# EAGLE design Arduino_CS (EAGLE 7.2.0)

## Sheet 1 of 2: Input Layer
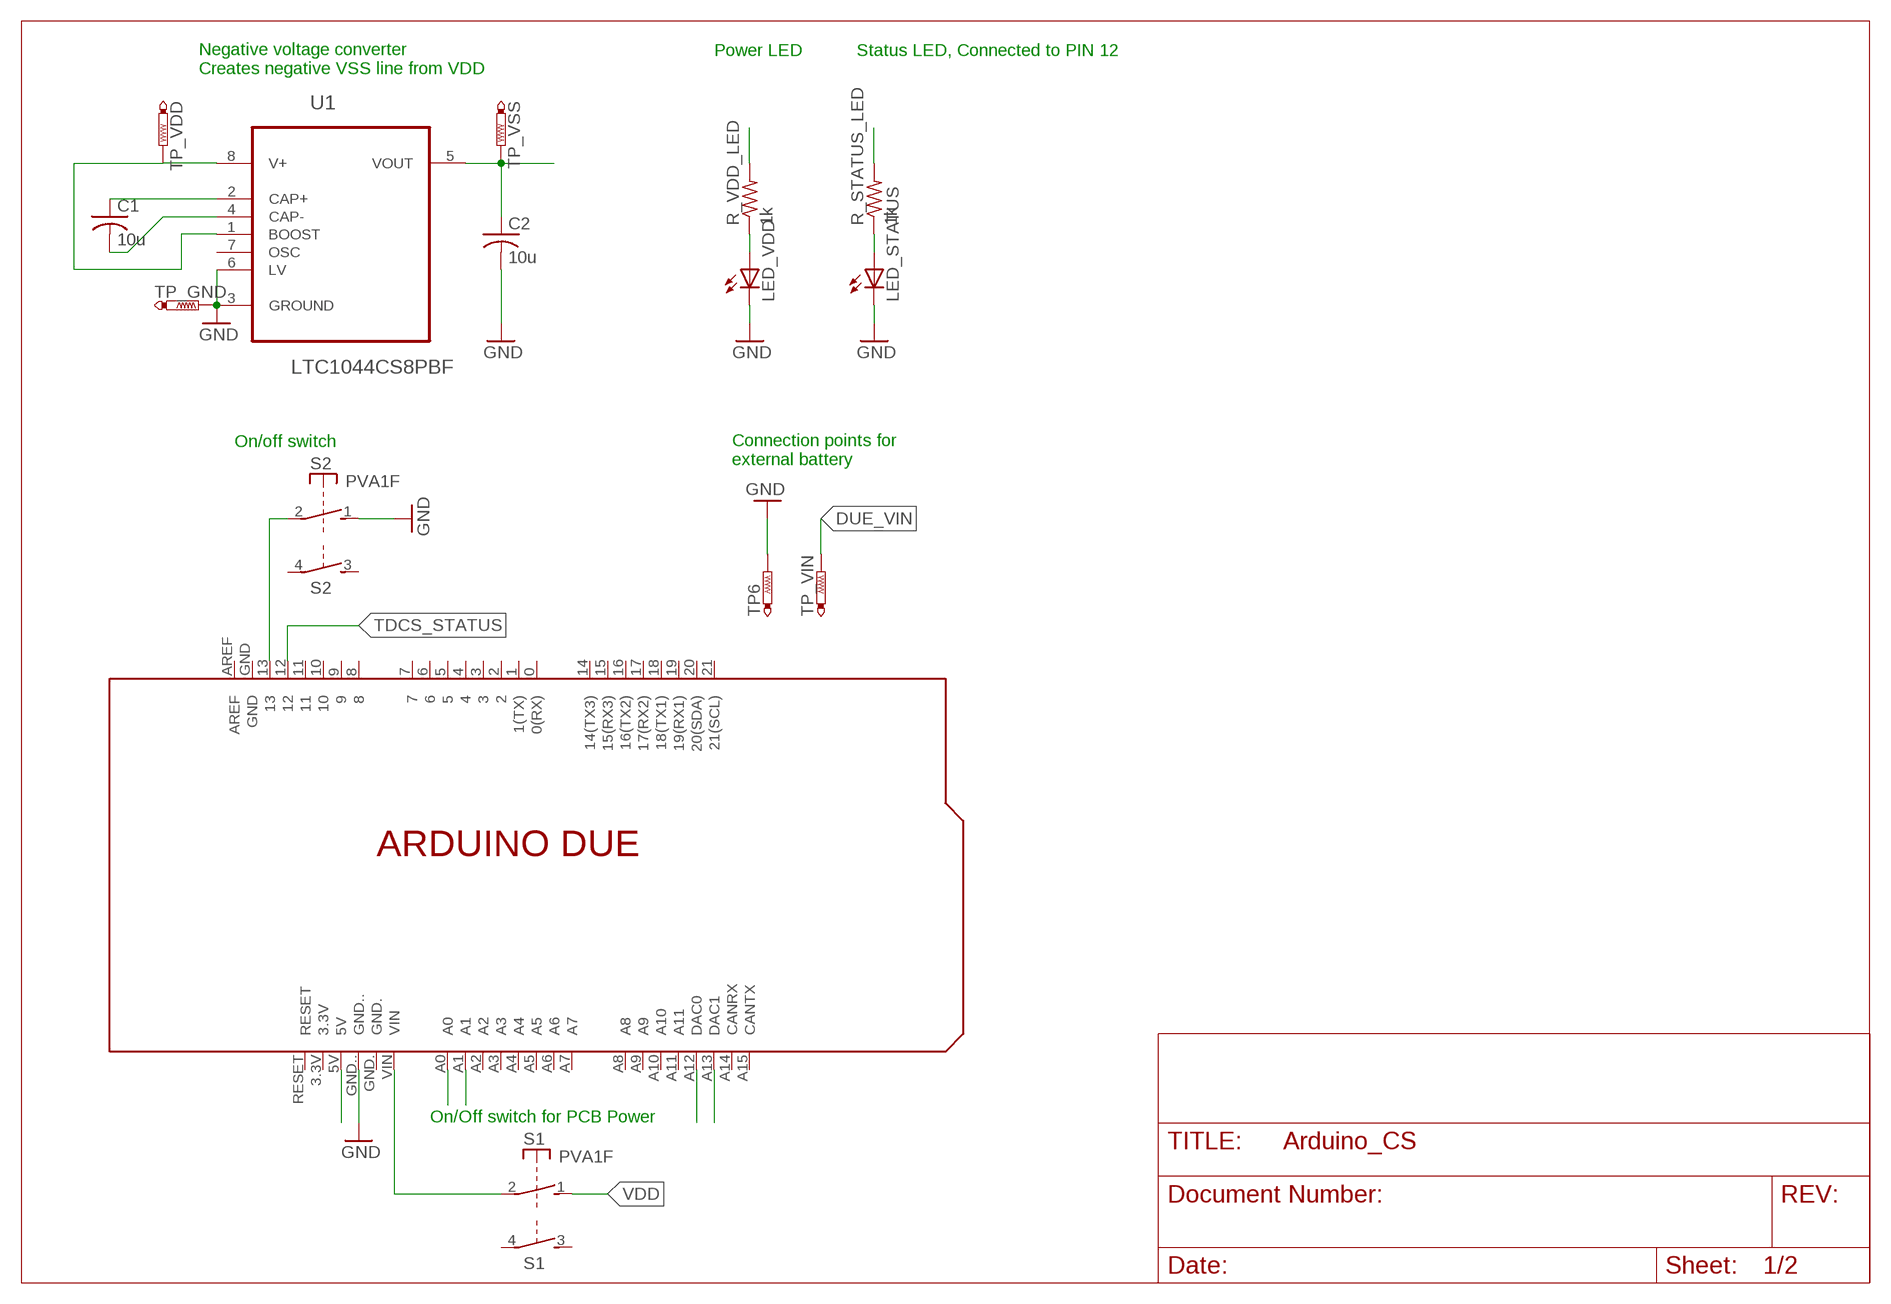
[diagram p0: schematic, sheet 1]

### Parts
C1  10u  C-USC0805  [C0805]
C2  10u  C-USC0805  [C0805]
LED_STATUS  LEDSML0805  [SML0805]
LED_VDD  LEDSML0805  [SML0805]
PCB1  ARDUINO_DUE  [ARDUINO_DUE]
R_STATUS_LED  1k  R-US_M0805  [M0805]
R_VDD_LED  1k  R-US_M0805  [M0805]
S1  PVA1F  [PVA1F]
S2  PVA1F  [PVA1F]
TP6  PTR1PAD1-13  [P1-13]
TP_GND  PTR1PAD1-13  [P1-13]
TP_VDD  PTR1PAD1-13  [P1-13]
TP_VIN  PTR1PAD1-13  [P1-13]
TP_VSS  PTR1PAD1-13  [P1-13]
U1  LTC1044CS8PBF  [SOIC127P600X175-8N]

### Nets
A0: PCB1.A0 ; also sheet 2
A1: PCB1.A1
DAC0: PCB1.A12(DAC0) ; also sheet 2
DAC1: PCB1.A13(DAC1)
DUE_5V: PCB1.5V ; also sheet 2
DUE_VIN: PCB1.VIN S1.2(1:P) TP_VIN.TP
GND: C2.2 LED_STATUS.C LED_VDD.C PCB1.GND.. S2.1(1:S) TP6.TP TP_GND.TP U1.3(GROUND) U1.6(LV) ; also sheet 2
N$5: PCB1.13 S2.2(1:P)
N$15: C1.1 U1.2(CAP+)
N$16: C1.2 U1.4(CAP-)
N$18: LED_STATUS.A R_STATUS_LED.1
N$21: LED_VDD.A R_VDD_LED.1
TDCS_STATUS: PCB1.12 R_STATUS_LED.2
VDD: R_VDD_LED.2 S1.1(1:S) TP_VDD.TP U1.1(BOOST) U1.8(V+) ; also sheet 2
VSS: C2.1 TP_VSS.TP U1.5(VOUT) ; also sheet 2
Unconnected: PCB1.0(0(RX)) PCB1.1(1(TX)) PCB1.2 PCB1.3 PCB1.3.3V PCB1.4 PCB1.5 PCB1.6 PCB1.7 PCB1.8 PCB1.9 PCB1.10 PCB1.11 PCB1.14(14(TX3)) PCB1.15(15(RX3)) PCB1.16(16(TX2)) PCB1.17(17(RX2)) PCB1.18(18(TX1)) PCB1.19(19(RX1)) PCB1.20(20(SDA)) PCB1.21(21(SCL)) PCB1.A2 PCB1.A3 PCB1.A4 PCB1.A5 PCB1.A6 PCB1.A7 PCB1.A8 PCB1.A9 PCB1.A10 PCB1.A11 PCB1.A14(CANRX) PCB1.A15(CANTX) PCB1.AREF PCB1.GND PCB1.GND. PCB1.RESET S1.3(2:S) S1.4(2:P) S2.3(2:S) S2.4(2:P) U1.7(OSC)

### Notes on the sheet
- Power LED | Status LED, Connected to PIN 12
- Negative voltage converter
  Creates negative VSS line from VDD
- On/off switch
- Connection points for
  external battery
- On/Off switch for PCB Power

## Sheet 2 of 2: Current Source Block
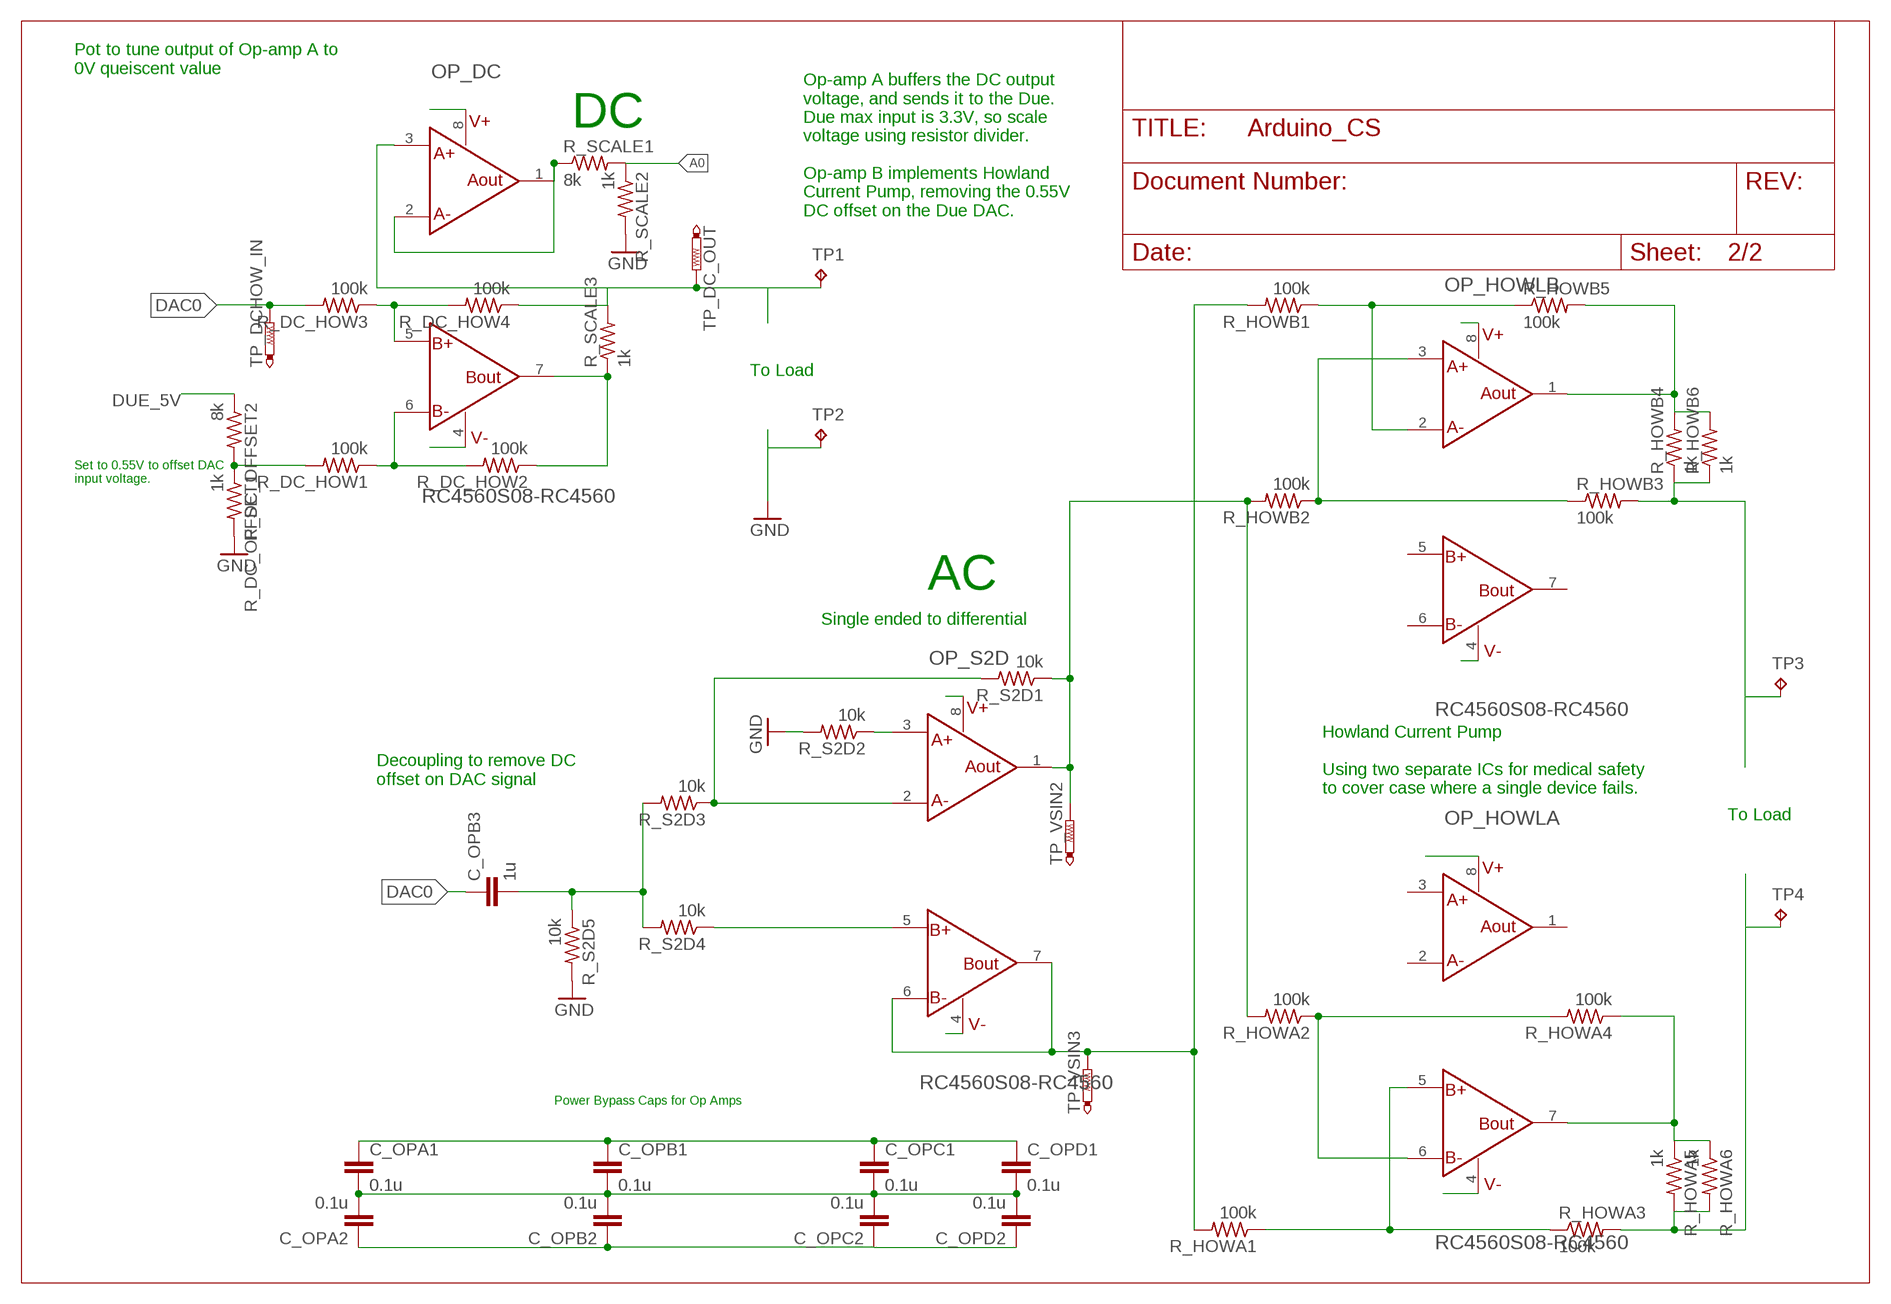
[diagram p1: schematic, sheet 2]

### Parts
C_OPA1  0.1u  C-EUC0805  [C0805]
C_OPA2  0.1u  C-EUC0805  [C0805]
C_OPB1  0.1u  C-EUC0805  [C0805]
C_OPB2  0.1u  C-EUC0805  [C0805]
C_OPB3  1u  C-EUC0805  [C0805]
C_OPC1  0.1u  C-EUC0805  [C0805]
C_OPC2  0.1u  C-EUC0805  [C0805]
C_OPD1  0.1u  C-EUC0805  [C0805]
C_OPD2  0.1u  C-EUC0805  [C0805]
OP_DC  RC4560S08-RC4560  [SO8]
OP_HOWLA  RC4560S08-RC4560  [SO8]
OP_HOWLB  RC4560S08-RC4560  [SO8]
OP_S2D  RC4560S08-RC4560  [SO8]
R_DC_HOW1  100k  R-US_R0805  [R0805]
R_DC_HOW2  100k  R-US_R0805  [R0805]
R_DC_HOW3  100k  R-US_R0805  [R0805]
R_DC_HOW4  100k  R-US_R0805  [R0805]
R_DC_OFFSET1  1k  R-US_R0805  [R0805]
R_DC_OFFSET2  8k  R-US_R0805  [R0805]
R_HOWA1  100k  R-US_R0805  [R0805]
R_HOWA2  100k  R-US_R0805  [R0805]
R_HOWA3  100k  R-US_R0805  [R0805]
R_HOWA4  100k  R-US_R0805  [R0805]
R_HOWA5  1k  R-US_R0805  [R0805]
R_HOWA6  1k  R-US_R0805  [R0805]
R_HOWB1  100k  R-US_R0805  [R0805]
R_HOWB2  100k  R-US_R0805  [R0805]
R_HOWB3  100k  R-US_R0805  [R0805]
R_HOWB4  1k  R-US_R0805  [R0805]
R_HOWB5  100k  R-US_R0805  [R0805]
R_HOWB6  1k  R-US_R0805  [R0805]
R_S2D1  10k  R-US_R0805  [R0805]
R_S2D2  10k  R-US_R0805  [R0805]
R_S2D3  10k  R-US_R0805  [R0805]
R_S2D4  10k  R-US_R0805  [R0805]
R_S2D5  10k  R-US_R0805  [R0805]
R_SCALE1  8k  R-US_R0805  [R0805]
R_SCALE2  1k  R-US_R0805  [R0805]
R_SCALE3  1k  R-US_R0805  [R0805]
TP1  TPPAD1-20  [P1-20]
TP2  TPPAD1-20  [P1-20]
TP3  TPPAD1-20  [P1-20]
TP4  TPPAD1-20  [P1-20]
TP_DC_OUT  PTR1PAD1-13  [P1-13]
TP_DCHOW_IN  PTR1PAD1-13  [P1-13]
TP_VSIN2  PTR1PAD1-13  [P1-13]
TP_VSIN3  PTR1PAD1-13  [P1-13]

### Nets
A0: R_SCALE1.2 R_SCALE2.1 ; also sheet 1
DAC0: C_OPB3.1 R_DC_HOW3.2 TP_DCHOW_IN.TP ; also sheet 1
DUE_5V: R_DC_OFFSET2.1 ; also sheet 1
GND: C_OPA1.2 C_OPA2.2 C_OPB1.2 C_OPB2.2 C_OPC1.2 C_OPC2.2 C_OPD1.2 C_OPD2.2 R_DC_OFFSET1.2 R_S2D2.2 R_S2D5.2 R_SCALE2.2 TP2.TP ; also sheet 1
N$1: OP_DC.6(NEGB) R_DC_HOW1.1 R_DC_HOW2.2
N$2: R_DC_HOW1.2 R_DC_OFFSET1.1 R_DC_OFFSET2.2
N$3: C_OPB3.2 R_S2D3.2 R_S2D4.2 R_S2D5.1
N$4: OP_S2D.6(NEGB) OP_S2D.7(OUTB) R_HOWA1.2 R_HOWB1.2 TP_VSIN3.TP
N$6: OP_S2D.5(POSB) R_S2D4.1
N$7: OP_HOWLA.5(POSB) R_HOWA1.1 R_HOWA3.1
N$8: OP_S2D.1(OUTA) R_HOWA2.2 R_HOWB2.2 R_S2D1.1 TP_VSIN2.TP
N$9: OP_S2D.3(POSA) R_S2D2.1
N$10: OP_S2D.2(NEGA) R_S2D1.2 R_S2D3.1
N$11: OP_HOWLB.3(POSA) R_HOWB2.1 R_HOWB3.1
N$12: OP_HOWLB.2(NEGA) R_HOWB1.1 R_HOWB5.1
N$13: R_HOWB3.2 R_HOWB4.1 R_HOWB6.1 TP3.TP
N$14: R_HOWA3.2 R_HOWA5.2 R_HOWA6.2 TP4.TP
N$17: OP_HOWLA.7(OUTB) R_HOWA4.1 R_HOWA5.1 R_HOWA6.1
N$19: OP_DC.7(OUTB) R_DC_HOW2.1 R_SCALE3.1
N$20: OP_HOWLA.6(NEGB) R_HOWA2.1 R_HOWA4.2
N$22: OP_DC.1(OUTA) OP_DC.2(NEGA) R_SCALE1.1
N$24: OP_HOWLB.1(OUTA) R_HOWB4.2 R_HOWB5.2 R_HOWB6.2
N$25: OP_DC.3(POSA) R_DC_HOW4.1 R_SCALE3.2 TP1.TP TP_DC_OUT.TP
N$26: OP_DC.5(POSB) R_DC_HOW3.1 R_DC_HOW4.2
VDD: C_OPA1.1 C_OPB1.1 C_OPC1.1 C_OPD1.1 OP_DC.8(V+) OP_HOWLA.8(V+) OP_HOWLB.8(V+) OP_S2D.8(V+) ; also sheet 1
VSS: C_OPA2.1 C_OPB2.1 C_OPC2.1 C_OPD2.1 OP_DC.4(V-) OP_HOWLA.4(V-) OP_HOWLB.4(V-) OP_S2D.4(V-) ; also sheet 1
Unconnected: OP_HOWLA.1(OUTA) OP_HOWLA.2(NEGA) OP_HOWLA.3(POSA) OP_HOWLB.5(POSB) OP_HOWLB.6(NEGB) OP_HOWLB.7(OUTB)

### Notes on the sheet
- Pot to tune output of Op-amp A to
  0V queiscent value
- DC
- Op-amp A buffers the DC output
  voltage, and sends it to the Due.
  Due max input is 3.3V, so scale
  voltage using resistor divider.
  
  Op-amp B implements Howland
  Current Pump, removing the 0.55V
  DC offset on the Due DAC.
- To Load
- Set to 0.55V to offset DAC
  input voltage.
- AC
- Single ended to differential
- Decoupling to remove DC
  offset on DAC signal
- Howland Current Pump
  
  Using two separate ICs for medical safety
  to cover case where a single device fails.
- To Load
- Power Bypass Caps for Op Amps

## Library data of the parts
C1 C2 = adafruit:C-US: CAPACITOR, American symbol
C_OPA1 C_OPA2 C_OPB1-C_OPB3 C_OPC1 C_OPC2 C_OPD1 C_OPD2 = resistor:C-EU: CAPACITOR, European symbol
LED_STATUS LED_VDD = led:LED: LED OSRAM: - CHIPLED LG R971, LG N971, LY N971, LG Q971, LY Q971, LO R971, LY R971 LH N974, LH R974 LS Q976, LO Q976, LY Q976 LO Q996 - Hyper CHIPLED LW Q18S LB Q993, LB Q99A, LB R99A - SideLED LS A670, LO A670, LY A670, LG A670, LP A670 LB A673, LV A673, LT A673, LW A673 LH A674 LY A675 LS A676, LA A676, LO A676, LY A676, LW A676 LS A679, LY A679, LG A679 - Hyper Micro SIDELED® LS Y876, LA Y876, LO Y876, LY Y876 LT Y87S - SmartLED LW L88C, LW L88S LB L89C, LB L89S, LG L890 LS L89K, LO L89K, LY L89K LS L896, LA L896, LO L896, LY L896 - TOPLED LS T670, LO T670, LY T670, LG T670, LP T670 LSG T670, LSP T670, LSY T670, LOP T670, LYG T670 LG T671, LOG T671, LSG T671 LB T673, LV T673, LT T673, LW T673 LH T674 LS T676, LA T676, LO T676, LY T676, LB T676, LH T676, LSB T676, LW T676 LB T67C, LV T67C, LT T67C, LS T67K, LO T67K, LY T67K, LW E67C LS E67B, LA E67B, LO E67B, LY E67B, LB E67C, LV E67C, LT E67C LW T67C LS T679, LY T679, LG T679 LS T770, LO T770, LY T770, LG T770, LP T770 LB T773, LV T773, LT T773, LW T773 LH T774 LS E675, LA E675, LY E675, LS T675 LS T776, LA T776, LO T776, LY T776, LB T776 LHGB T686 LT T68C, LB T68C - Hyper Mini TOPLED® LB M676 - Mini TOPLED Santana® LG M470 LS M47K, LO M47K, LY M47K Source: http://www.osram.convergy.de LUXEON: - LUMILED® LXK2-PW12-R00, LXK2-PW12-S00, LXK2-PW14-U00, LXK2-PW14-V00 LXK2-PM12-R00, LXK2-PM12-S00, LXK2-PM14-U00 LXK2-PE12-Q00, LXK2-PE12-R00, LXK2-PE12-S00, LXK2-PE14-T00, LXK2-PE14-U00 LXK2-PB12-K00, LXK2-PB12-L00, LXK2-PB12-M00, LXK2-PB14-N00, LXK2-PB14-P00, LXK2-PB14-Q00 LXK2-PR12-L00, LXK2-PR12-M00, LXK2-PR14-Q00, LXK2-PR14-R00 LXK2-PD12-Q00, LXK2-PD12-R00, LXK2-PD12-S00 LXK2-PH12-R00, LXK2-PH12-S00 LXK2-PL12-P00, LXK2-PL12-Q00, LXK2-PL12-R00 Source: www.luxeon.com KINGBRIGHT: KA-3528ASYC Source: www.kingbright.com
OP_DC OP_HOWLA OP_HOWLB OP_S2D = RC4560:RC4560: RC4560 Op-Amp Texas Instruments
PCB1 = DUE_TDCS:ARDUINO_DUE: Device for representing an Arduino Due board with a footprint in an EAGLE design. Created by Dave Young for Element14. More EAGLE documentation at: http://www.element14.com/community/community/knode/cadsoft_eagle
R_DC_HOW1-R_DC_HOW4 R_DC_OFFSET1 R_DC_OFFSET2 R_HOWA1-R_HOWA6 R_HOWB1-R_HOWB6 R_S2D1-R_S2D5 R_SCALE1-R_SCALE3 = rcl:R-US_: RESISTOR, American symbol
R_STATUS_LED R_VDD_LED = resistor:R-US_: RESISTOR, American symbol
S1 S2 = switch-misc:PVA1: ITT SWITCH
TP1-TP4 = testpad:TP: Test pad
TP6 TP_DC_OUT TP_DCHOW_IN TP_GND TP_VDD TP_VIN TP_VSIN2 TP_VSIN3 TP_VSS = testpad:PTR1: TEST PIN
U1 = LTC_By_element14_Batch_1:LTC1044CS8PBF: Switched Capacitor Voltage Converter; MPN: LTC1044CS8#PBF; OC_FARNELL: 1663593; OC_NEWARK: 55M8900; PACKAGE: SOIC-8; SUPPLIER: Linear Technology

## Board
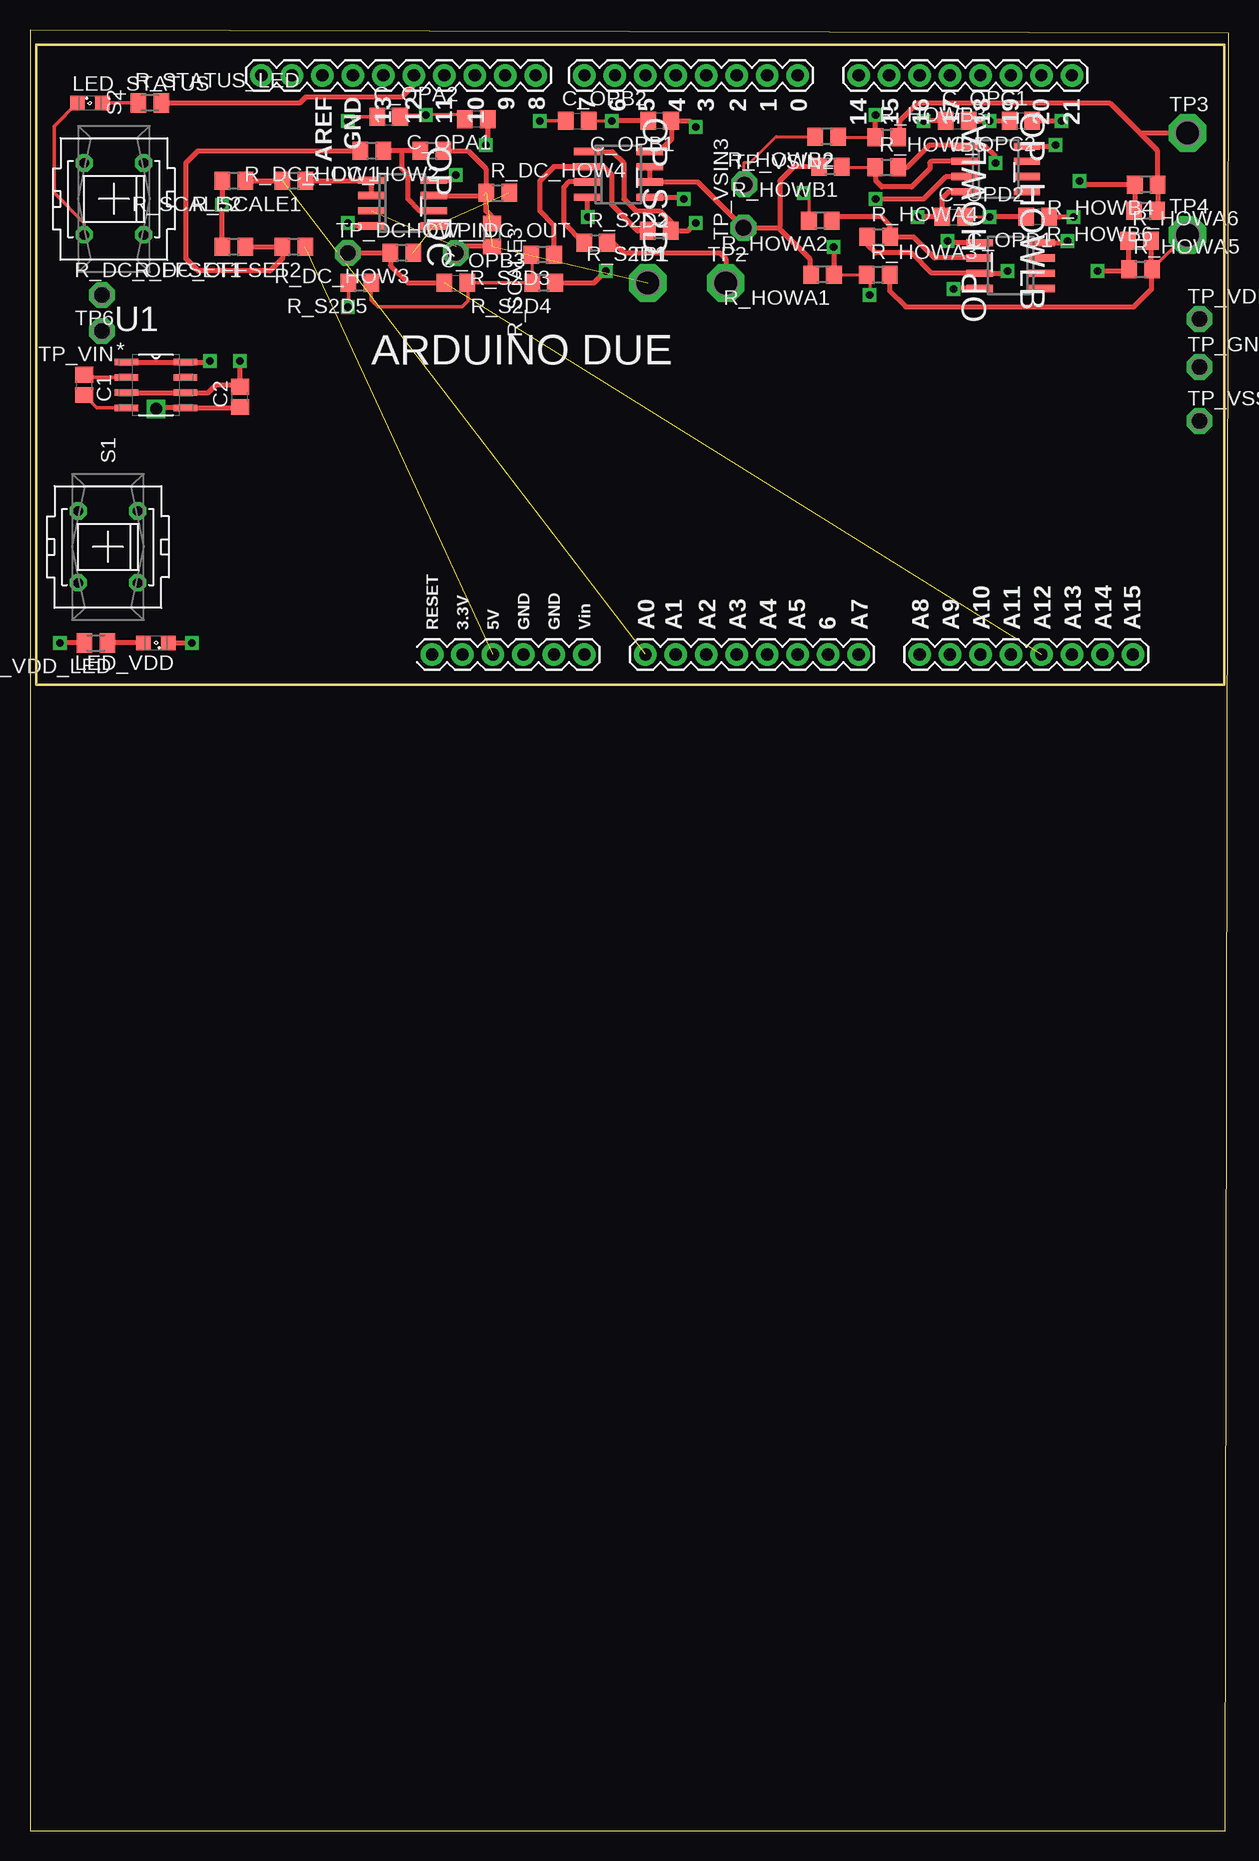
[diagram p2: board, top side]
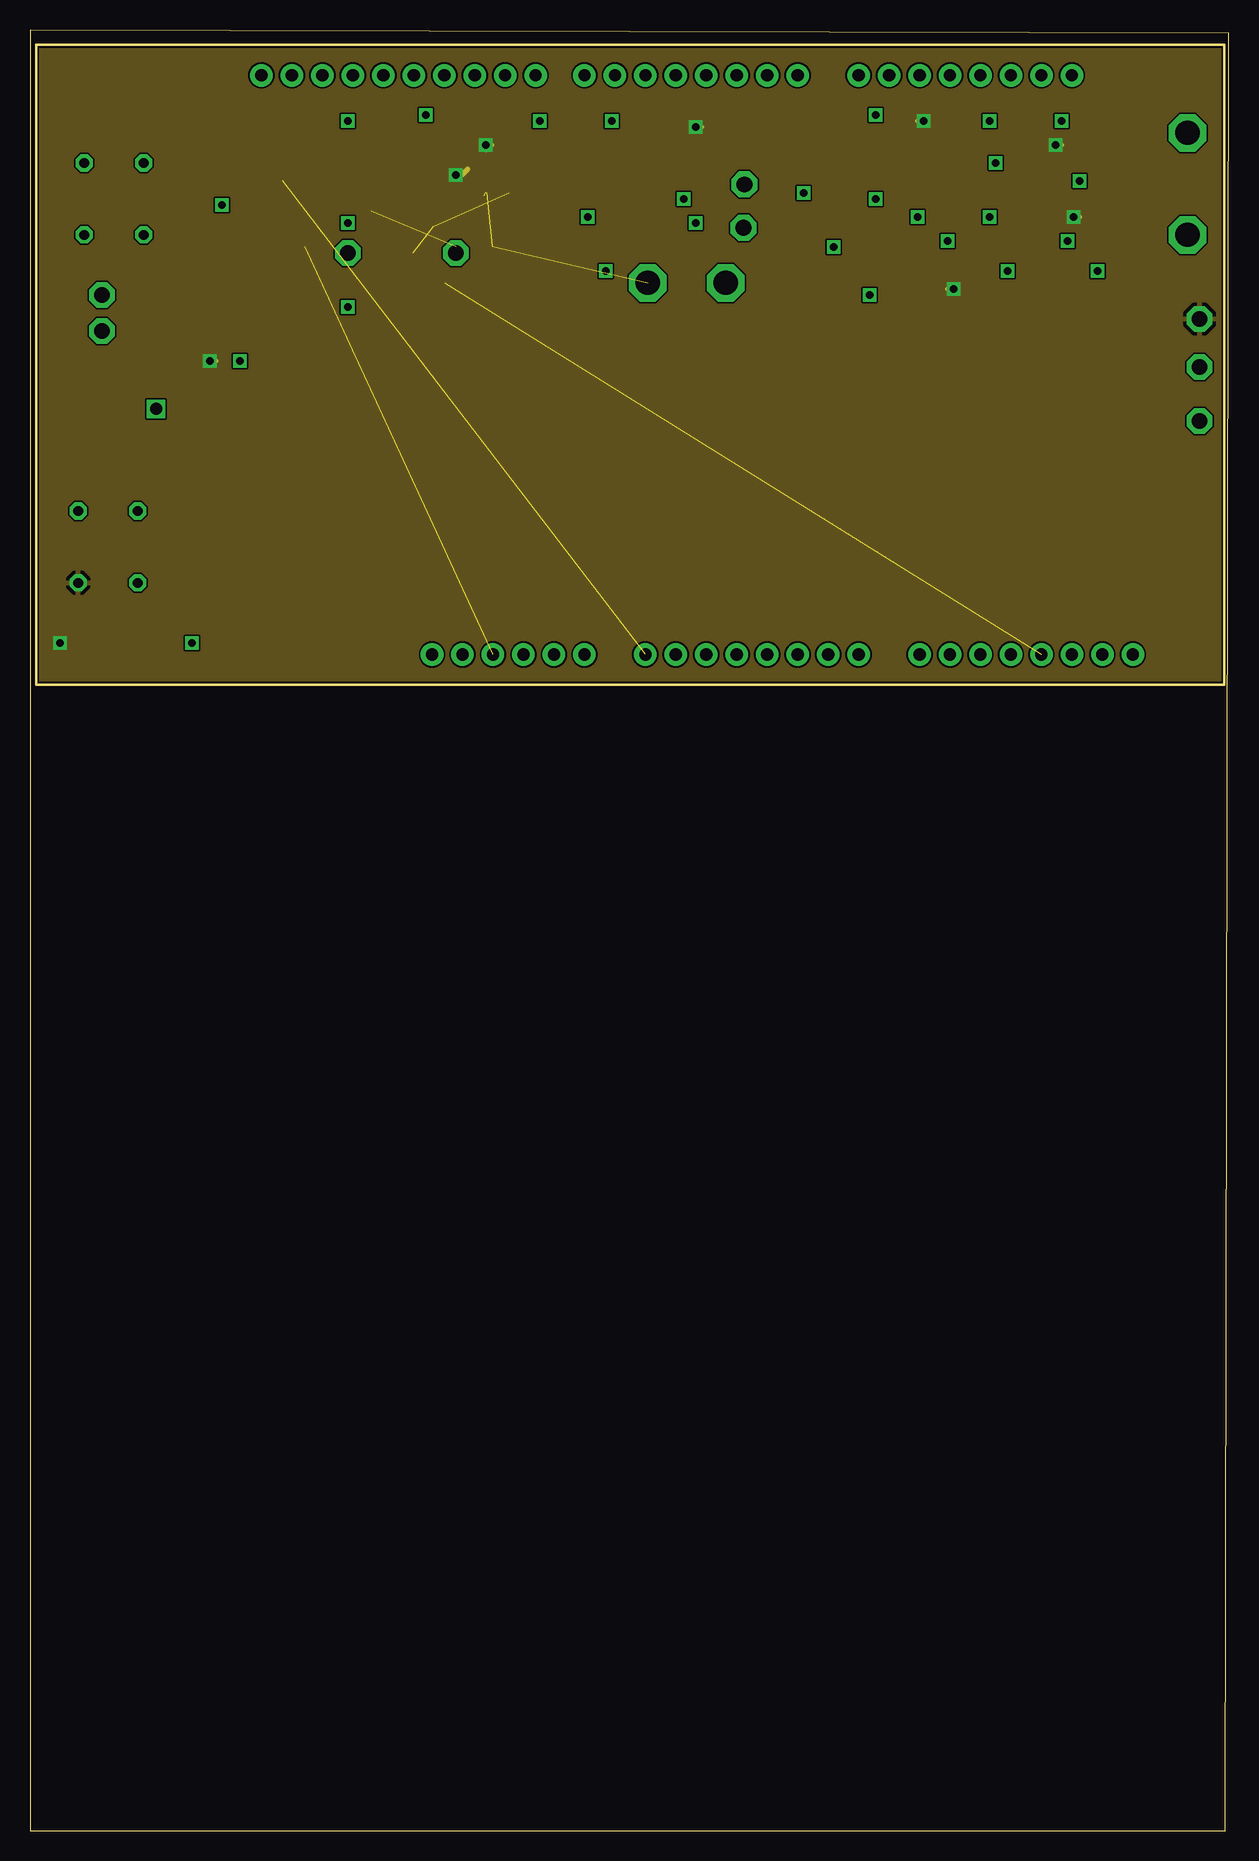
[diagram p3: board, inner layer VDD]
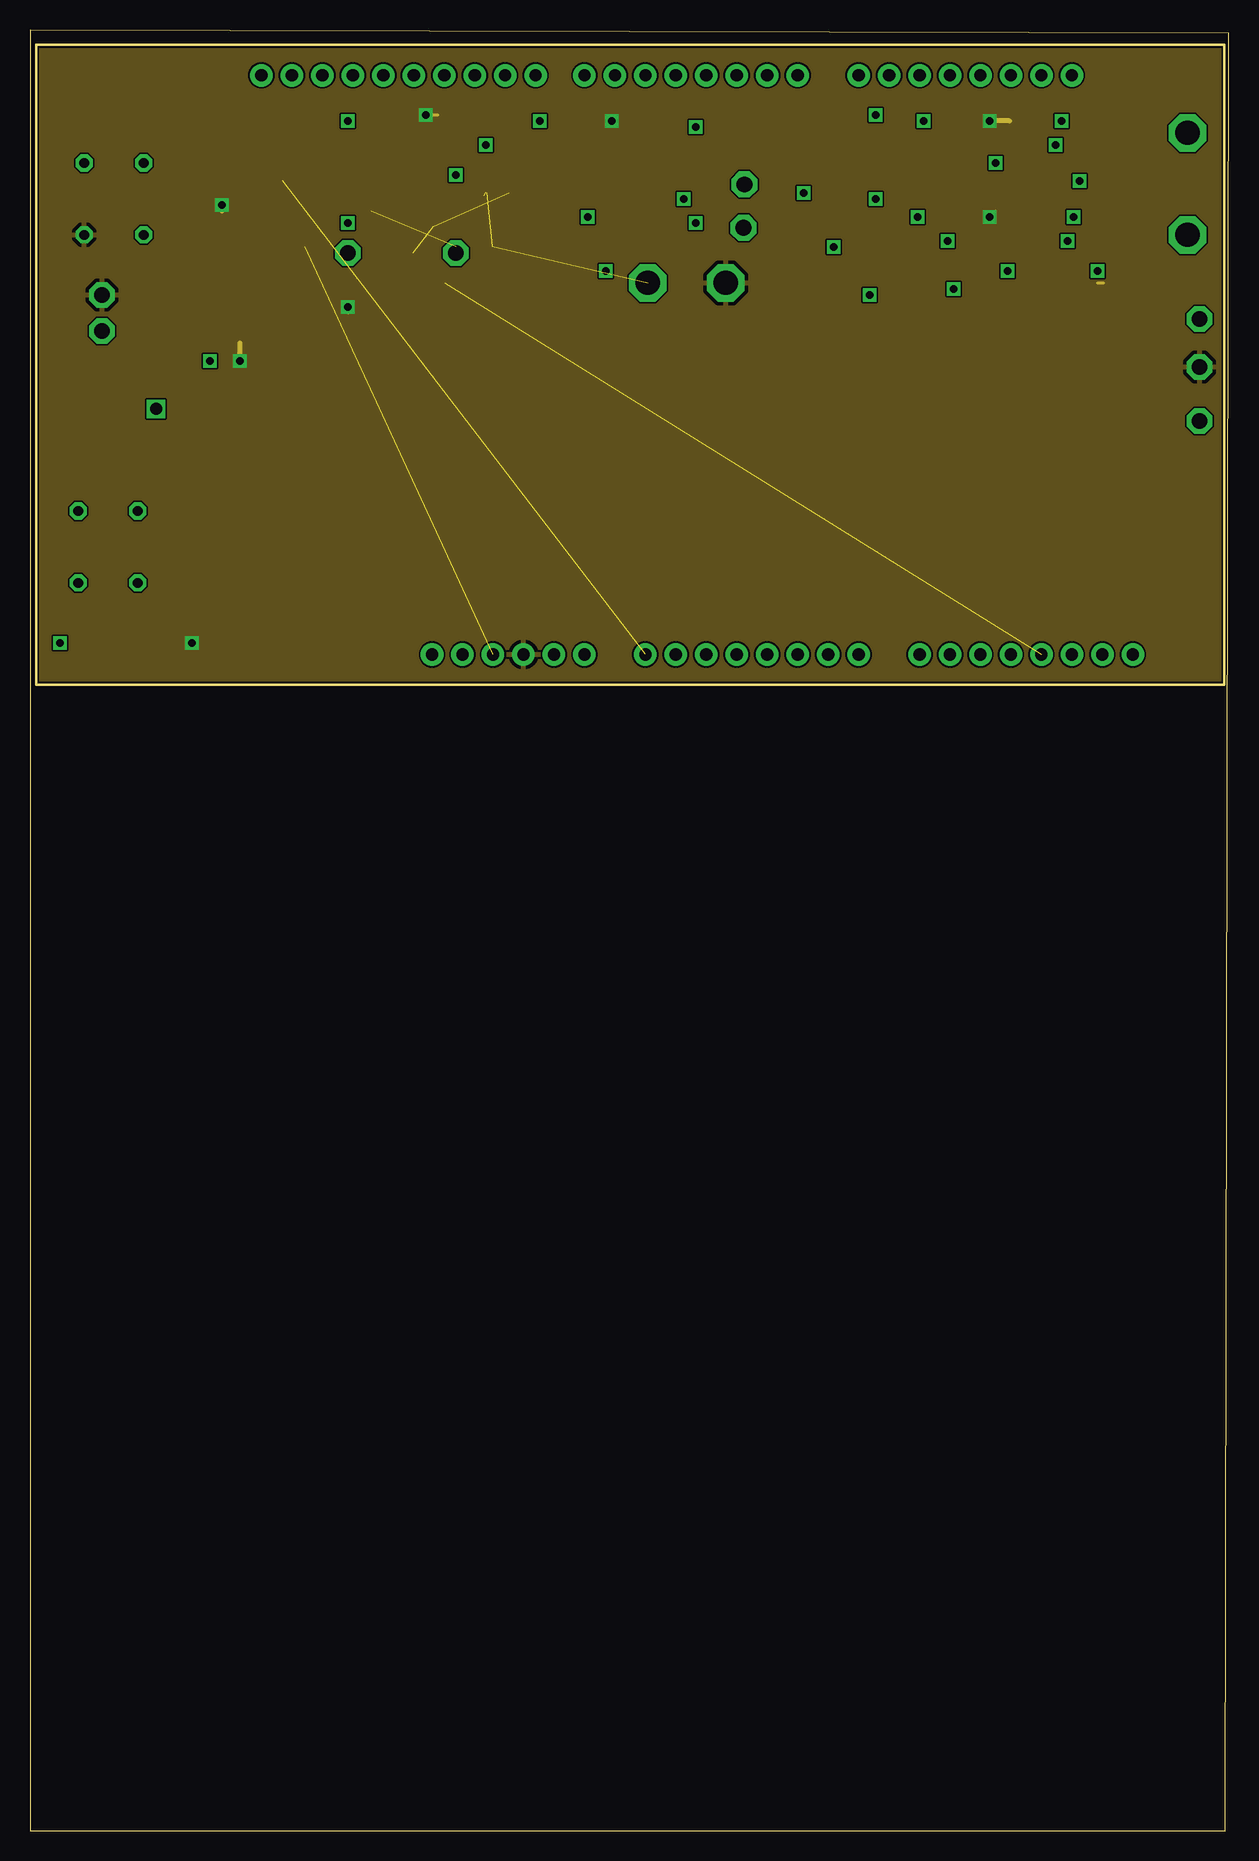
[diagram p4: board, inner layer GND]
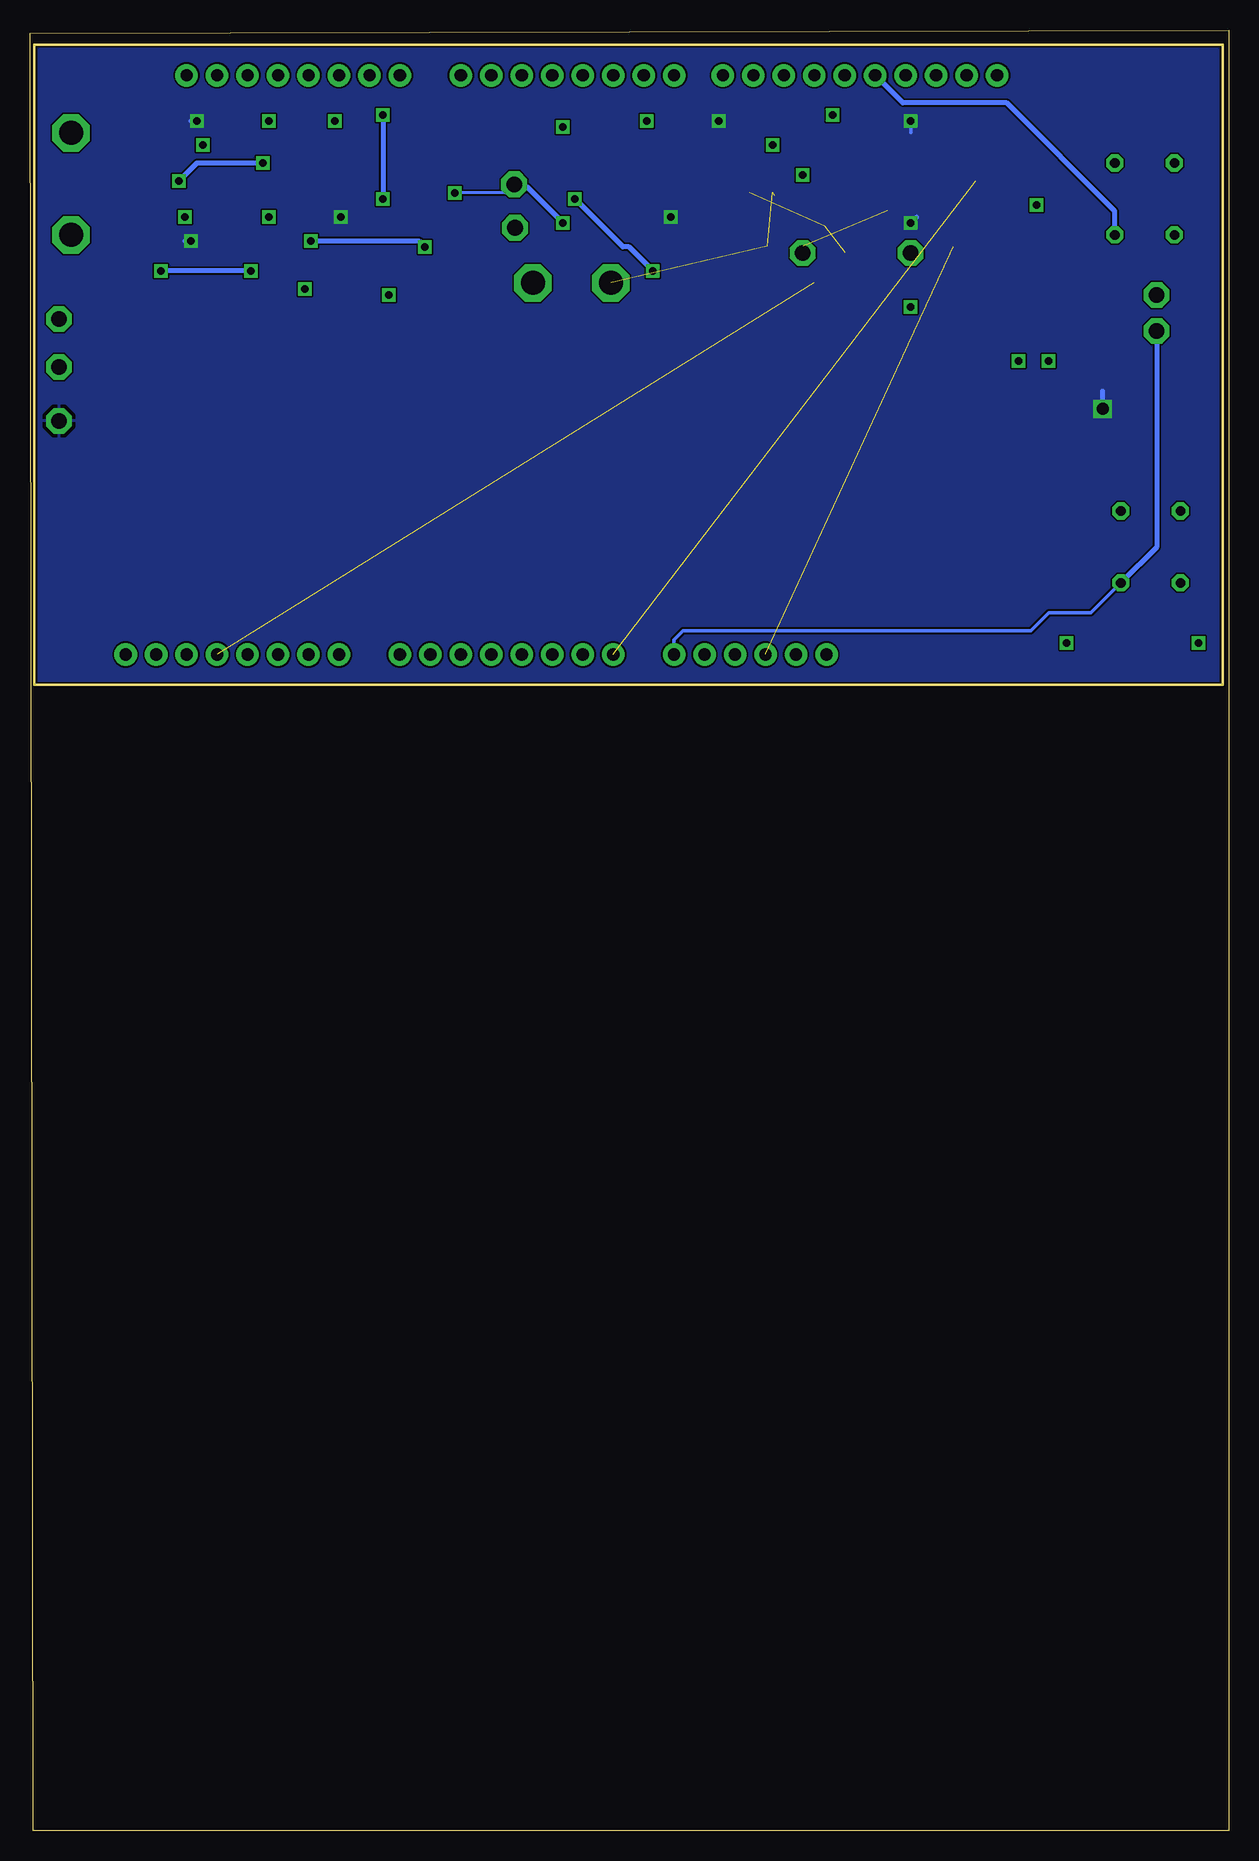
[diagram p5: board, bottom side, seen from below]

Size 99.92 x 150.08 mm. Coordinates in mm from the lower left corner, seen from the top.
Outline: 0,0 99.65,0 99.92,149.81 0,150.08 0,0
Copper layers (1*2*15*16): Top 0.035mm / dielectric 1.5mm / VDD 0.035mm / dielectric 0.15mm / GND 0.035mm / dielectric 0.2mm / Bottom 0.035mm
Design rules "SparkFun-4-layer": minimum track width 6mil, minimum drill 13mil, track to track 6mil, track to pad 6mil, pad to pad 6mil, via to via 6mil, smd to smd 6mil, copper to edge 6mil, drill to drill 8mil, minimum pad ring 12mil, minimum via ring 10mil, stop-mask expansion 4mil, vias tented up to drill 20mil, thermal gap 12mil

### Footprints (pad centres in the part's own frame; a part is rotated, then mirrored left to right if it is on the bottom)
C0805 = smd 1.3 x 1.5: 1 -0.85,0; 2 0.85,0
C0805' = smd 1.3 x 1.5: 1 -0.95,0; 2 0.95,0
SML0805 = smd 1.2 x 1.2: A 1.05,0; C -1.05,0
SO8 = smd 0.6 x 2.2: 1 -1.905,-2.6; 2 -0.635,-2.6; 3 0.635,-2.6; 4 1.905,-2.6; 5 1.905,2.6; 6 0.635,2.6; 7 -0.635,2.6; 8 -1.905,2.6
ARDUINO_DUE = drill 1.016 pad 1.88: 0 63.5,50.8; 1 60.96,50.8; 2 58.42,50.8; 3 55.88,50.8; 3.3V 35.56,2.54; 4 53.34,50.8; 5 50.8,50.8; 5V 38.1,2.54; 6 48.26,50.8; 7 45.72,50.8; 8 41.656,50.8; 9 39.116,50.8; 10 36.576,50.8; 11 34.036,50.8; 12 31.496,50.8; 13 28.956,50.8; 14 68.58,50.8; 15 71.12,50.8; 16 73.66,50.8; 17 76.2,50.8; 18 78.74,50.8; 19 81.28,50.8; 20 83.82,50.8; 21 86.36,50.8; A0 50.8,2.54; A1 53.34,2.54; A2 55.88,2.54; A3 58.42,2.54; A4 60.96,2.54; A5 63.5,2.54; A6 66.04,2.54; A7 68.58,2.54; A8 73.66,2.54; A9 76.2,2.54; A10 78.74,2.54; A11 81.28,2.54; A12 83.82,2.54; A13 86.36,2.54; A14 88.9,2.54; A15 91.44,2.54; AREF 23.876,50.8; GND 26.416,50.8; GND. 43.18,2.54; GND.. 40.64,2.54; RESET 33.02,2.54; SCL1 18.796,50.8; SDA1 21.336,50.8; VIN 45.72,2.54
R0805 = smd 1.3 x 1.5: 1 -0.95,0; 2 0.95,0
M0805 = smd 1.3 x 1.6: 1 -0.95,0; 2 0.95,0
PVA1F = drill 0.813 octagon: 1 -2.997,2.489; 2 -2.997,-2.489; 3 2.997,2.489; 4 2.997,-2.489
P1-20 = drill 2.007 pad 3.15 octagon: TP 0,0
P1-13 = drill 1.321 pad 2.159 octagon: TP 0,0
SOIC127P600X175-8N = smd 1.981 x 0.533: 1 -2.464,1.905; 2 -2.464,0.635; 3 -2.464,-0.635; 4 -2.464,-1.905; 5 2.464,-1.905; 6 2.464,-0.635; 7 2.464,0.635; 8 2.464,1.905

### Placement (x,y rotation side)
C1  4.5,120.5 270 top
C2  17.5,119.5 90 top
C_OPA1  0.1u  [C0805']  37.21,142.65 180 top
C_OPA2  0.1u  [C0805']  29.9,142.85 0 top
C_OPB1  0.1u  [C0805']  52.49,142.5 180 top
C_OPB2  0.1u  [C0805']  45.62,142.5 0 top
C_OPB3  1u  [C0805']  35.5,129 0 top
C_OPC1  0.1u  [C0805']  77.29,142.5 0 top
C_OPC2  0.1u  [C0805']  82.6,142.5 180 top
C_OPD1  0.1u  [C0805']  84,134.5 180 top
C_OPD2  0.1u  [C0805']  77,134.5 0 top
LED_STATUS  5,144 0 top
LED_VDD  10.5,99 180 top
OP_DC  31.05,135.65 270 top
OP_HOWLA  81.75,130.45 90 top
OP_HOWLB  80.5,138.5 270 top
OP_S2D  49.05,138.05 270 top
PCB1  0.5,95.5 0 top
R_DC_HOW1  28.5,140 180 top
R_DC_HOW2  33.5,140 180 top
R_DC_HOW3  31,131.5 180 top
R_DC_HOW4  39,136.5 0 top
R_DC_OFFSET1  17,132 180 top
R_DC_OFFSET2  22,132 180 top
R_HOWA1  66.07,129.7 180 top
R_HOWA2  65.89,134.2 180 top
R_HOWA3  70.71,129.7 0 top
R_HOWA4  70.75,132.85 0 top
R_HOWA5  92.59,130.15 0 top
R_HOWA6  92.5,132.5 0 top
R_HOWB1  66.73,138.7 180 top
R_HOWB2  66.41,141.2 180 top
R_HOWB3  71.43,141.15 0 top
R_HOWB4  93.05,137.2 180 top
R_HOWB5  71.41,138.65 0 top
R_HOWB6  93,135 180 top
R_S2D1  52.46,133.35 180 top
R_S2D2  47.15,132.35 0 top
R_S2D3  42.74,131.35 180 top
R_S2D4  42.82,129 180 top
R_S2D5  27.5,129 180 top
R_SCALE1  22,137.5 180 top
R_SCALE2  17,137.5 180 top
R_SCALE3  38.5,133 270 top
R_STATUS_LED  10,144 0 top
R_VDD_LED  5.5,99 180 top
S1  6.5,107 90 top
S2  7,136 90 top
TP1  51.5,129 0 top
TP2  58,129 0 top
TP3  96.5,141.5 0 top
TP4  96.5,133 0 top
TP6  6,128 180 top
TP_DC_OUT  35.5,131.5 0 top
TP_DCHOW_IN  26.5,131.5 0 top
TP_GND  97.5,122 0 top
TP_VDD  97.5,126 0 top
TP_VIN  6,125 180 top
TP_VSIN2  59.55,137.21 0 top
TP_VSIN3  59.49,133.59 90 top
TP_VSS  97.5,117.5 0 top
U1  10.5,120.5 0 top

### Tracks (layer width: path | path; a pad name or v marks a point on that pad's centre or on a via)
A0  (1 unrouted)
  Top 0.406: R_SCALE2.1 R_SCALE1.2
DAC0  (1 unrouted)
  Top 0.406: TP_DCHOW_IN.TP R_DC_HOW3.2 30.05,130.45 31.5,129 C_OPB3.1
DUE_5V  (1 unrouted)
DUE_VIN
  Bottom 0.305: PCB1.VIN 46.22,99.28 45.5,100 16.5,100 15,101.5 11.49,101.5 S1.2
  Bottom 0.406: TP_VIN.TP 6,106.99 S1.2
GND  (via drill 0.6)
  Top 0.254: C_OPA2.2 31,143 v33,143 35.91,143 C_OPA1.2 | 46.5,142.5 C_OPB2.2 v48.5,142.5 | C_OPD2.2 v80,134.5
  Top 0.305: 31,142.7 C_OPA2.2 | S2.1 4.51,133.99 2,136.5 2,142.05 LED_STATUS.C | R_S2D5.2 26.55,127.05 v26.5,127
  Top 0.406: v17.5,122.5 C2.2 17.35,120.5 15.5,120.5 14.87,119.86 U1.6 U1.3 | LED_VDD.C v13.5,99 | R_SCALE2.2 16,137.5 v16,135.5 16,132 R_DC_OFFSET1.2 | C_OPB1.2 v48.5,142.5 | R_S2D2.2 48.65,132.35 49.5,131.5 57.5,131.5 58,131 TP2.TP | C_OPD1.2 v80,134.5 | C_OPC1.2 v80,142.5 C_OPC2.2
  GND 0.254: v33,143 34,143 | 89,129 89.5,129 | v80,134.5 80.5,135
  GND 0.305: v26.5,127 26.5,126.5
  GND 0.406: v17.5,122.5 17.5,124 | v16,135.5 16,135 | C_OPC2.2 v80,142.5
  pour GND: 105,153 105,-5 -11,-5 -9.5,152.5 0.5,152.5
N$1
  Top 0.406: R_DC_HOW2.2 31,140 | 31,140 R_DC_HOW1.1 | OP_DC.6 32.48,135.01 31.5,136 31.5,138 31,138.5 31,140
N$2
  Top 0.406: R_DC_OFFSET1.1 R_DC_OFFSET2.2 21.05,131.05 20,130 14,130 13,131 13,139 14,140 R_DC_HOW1.2
N$3
  Top 0.254: R_S2D3.2 41.87,131.27 R_S2D4.2 41.36,129.51
  Top 0.305: R_S2D4.2 C_OPB3.2 36.5,128.95 36.5,127.5 36,127 29,127 28.45,127.55 R_S2D5.1
N$4
  Top 0.406: OP_S2D.7 OP_S2D.6 55.66,137.41 TP_VSIN3.TP 62.41,133.59 | 62.41,133.59 65,131 65,129.82 R_HOWA1.2 | R_HOWB1.2 63.7,138.7 62.5,137.5 62.5,133.68 62.41,133.59
N$5
  Bottom 0.406: S2.2 9.49,134.99 18.5,144 27.16,144 PCB1.13
N$6  (via drill 0.6)
  Top 0.406: R_S2D4.1 47,129 v48,130 | OP_S2D.5 54.35,136.15 v54.5,136
  Bottom 0.406: v48,130 50,132 50.5,132 v54.5,136
N$7  (via drill 0.6)
  Top 0.254: R_HOWA1.1 R_HOWA3.1 70,129.46 v70,128
  Top 0.406: OP_HOWLA.5 76.64,132.35 v76.5,132.5 | v67,132 67,129.72 R_HOWA1.1
  Bottom 0.406: v76.5,132.5 67.5,132.5 v67,132
N$8  (via drill 0.6)
  Top 0.254: TP_VSIN2.TP 59.5,137.26 59.5,139 60,139 62.2,141.2 R_HOWB2.2 | v64.5,136.5 64.94,136.06 R_HOWA2.2
  Top 0.406: OP_S2D.1 48.55,139.96 49.5,139 49.5,136 50.5,135 52.5,135 53.5,134 53.5,133.44 R_S2D1.1 54.85,133.35 v55.5,134
  Bottom 0.254: TP_VSIN2.TP 60.26,136.5 v64.5,136.5
  Bottom 0.406: v55.5,134 58.5,137 59.34,137 TP_VSIN2.TP
N$9
  Top 0.406: R_S2D2.1 46.15,132.35 44.5,134 44.5,137 44.91,137.41 OP_S2D.3
N$10
  Top 0.406: R_S2D3.1 43.69,133.81 42.5,135 42.5,137.5 43.69,138.69 OP_S2D.2 47.81,138.69 48.5,138 48.5,135.5 50.65,133.35 R_S2D1.2
N$11  (via drill 0.6)
  Top 0.254: R_HOWB2.1 67.41,141.15 R_HOWB3.1
  Top 0.406: R_HOWB3.1 70.48,142.98 v70.5,143 | v70.5,136 74.5,136 76.36,137.87 OP_HOWLB.3
  Bottom 0.406: v70.5,143 v70.5,136
N$12
  Top 0.254: R_HOWB1.1 67.73,138.65 R_HOWB5.1
  Top 0.406: OP_HOWLB.2 75.14,139.13 75,139 75,138.5 73.5,137 71,137 70.5,137.5 70.5,138.61 R_HOWB5.1
N$13
  Top 0.254: R_HOWB3.2 72.5,141.27
  Top 0.406: 72.5,141.27 72.5,142.5 74,144 90,144 92.5,141.5 | 92.5,141.5 TP3.TP | 92.5,141.5 94,140 R_HOWB4.1 94,135.05 R_HOWB6.1
N$14
  Top 0.305: TP4.TP 96.5,133.11 R_HOWA5.2
  Top 0.406: R_HOWA3.2 71.66,128.34 73,127 92,127 93.5,128.5 93.5,130.11 R_HOWA5.2 93.45,130.24 R_HOWA6.2
N$15
  Top 0.305: U1.2 4.71,121.14 C1.1
N$16
  Top 0.305: U1.4 5.55,118.59 C1.2
N$17  (via drill 0.6)
  Top 0.406: v81.5,130 81.31,129.81 OP_HOWLA.7 75.19,129.81 73.5,131.5 70.5,131.5 69.8,132.2 R_HOWA4.1 | v89,130 91.49,130 R_HOWA5.1 91.55,130.24 R_HOWA6.1
  Bottom 0.406: v81.5,130 v89,130
N$18
  Top 0.305: LED_STATUS.A R_STATUS_LED.1
N$19  (1 unrouted)
  Top 0.406: R_DC_HOW2.1 36.5,140 38,138.5 38,137 38,136.55 38,135 38.5,134.5 R_SCALE3.1 | OP_DC.7 37.84,136.28
N$20
  Top 0.254: R_HOWA2.1 66.89,134.15
  Top 0.406: R_HOWA2.1 67.14,134.5 71,134.5 71.7,133.8 R_HOWA4.2 73.65,132.85 75.42,131.09 OP_HOWLA.6
N$21
  Top 0.406: LED_VDD.A R_VDD_LED.1
N$22
  Top 0.406: R_SCALE1.1 28.45,137.5 OP_DC.1 OP_DC.2
N$24  (via drill 0.6)
  Top 0.406: v87.5,137.5 87.8,137.2 R_HOWB4.2 92.1,135.05 R_HOWB6.2 | v80.5,139 80.5,139.5 79.59,140.41 OP_HOWLB.1 77.81,140.5 75,140.5 73.15,138.65 R_HOWB5.2
  Bottom 0.406: v87.5,137.5 86,139 v80.5,139
N$25  (3 unrouted)
  Top 0.406: R_SCALE3.2 35.5,132.05 TP_DC_OUT.TP
N$26  (2 unrouted)
TDCS_STATUS
  Top 0.406: R_STATUS_LED.2 22.5,144 23,144.5 31,144.5 32,145.5 PCB1.12
VDD  (via drill 0.6)
  Top 0.406: v15,122.5 14.9,122.41 U1.8 U1.1 | R_VDD_LED.2 v2.5,99 | OP_DC.8 35.05,137.56 v35.5,138 | C_OPA1.1 38.16,140.66 v38,140.5 | v55.5,142 55,142.5 C_OPB1.1 53.5,142.44 53.5,141 52.45,139.96 OP_S2D.8 | C_OPD1.1 v87,134.5 | C_OPC1.1 v74.5,142.5 | OP_HOWLB.8 85.41,140.41 v85.5,140.5 | OP_HOWLA.8 77.05,128.54 v77,128.5
  VDD 0.305: v38,140.5 38,140
  VDD 0.406: v15,122.5 15.5,122.5 | v35.5,138 36,138 36.5,138.5 | v38,140.5 38.5,140.5 | v55.5,142 56,142 | v87,134.5 87.5,134.5 | v74.5,142.5 74,142.5 | v85.5,140.5 86,140.5 | v77,128.5 76.5,128.5
  pour VDD: -4,154 105.5,152 110,153 110,-31 -5,-5 -6,149
VSS  (via drill 0.6, 1)
  Top 0.305: 44.59,142.41 C_OPB2.1 v42.5,142.5 | C_OPA2.1 26.85,142.85 v26.5,142.5
  Top 0.406: v10.5,118.5 10.6,118.59 U1.5 17.45,118.59 C2.1 | OP_DC.4 26.75,133.75 v26.5,134 | C_OPC2.1 v86,142.5 | v74,134.5 C_OPD2.1 76,134.55 76,136 76.59,136.59 OP_HOWLB.4 | OP_HOWLA.4 86.36,132.35 v86.5,132.5 | OP_S2D.4 46.45,134.55 v46.5,134.5
  Bottom 0.305: v26.5,142.5 26.5,141.5
  Bottom 0.406: v10.5,118.5 10.5,120 | v26.5,134 26,134.5 | v86,142.5 86.5,142.5 | v86.5,132.5 87,132.5
  pour Bottom: -10,152.5 -9,154 108,154 107,150.5 107,-10.5 104,-7.5 -13,-7.5 -11.5,-6 -11.5,150 -10,147

### Text on the board
tValues: Vdiff A | Vdiff B